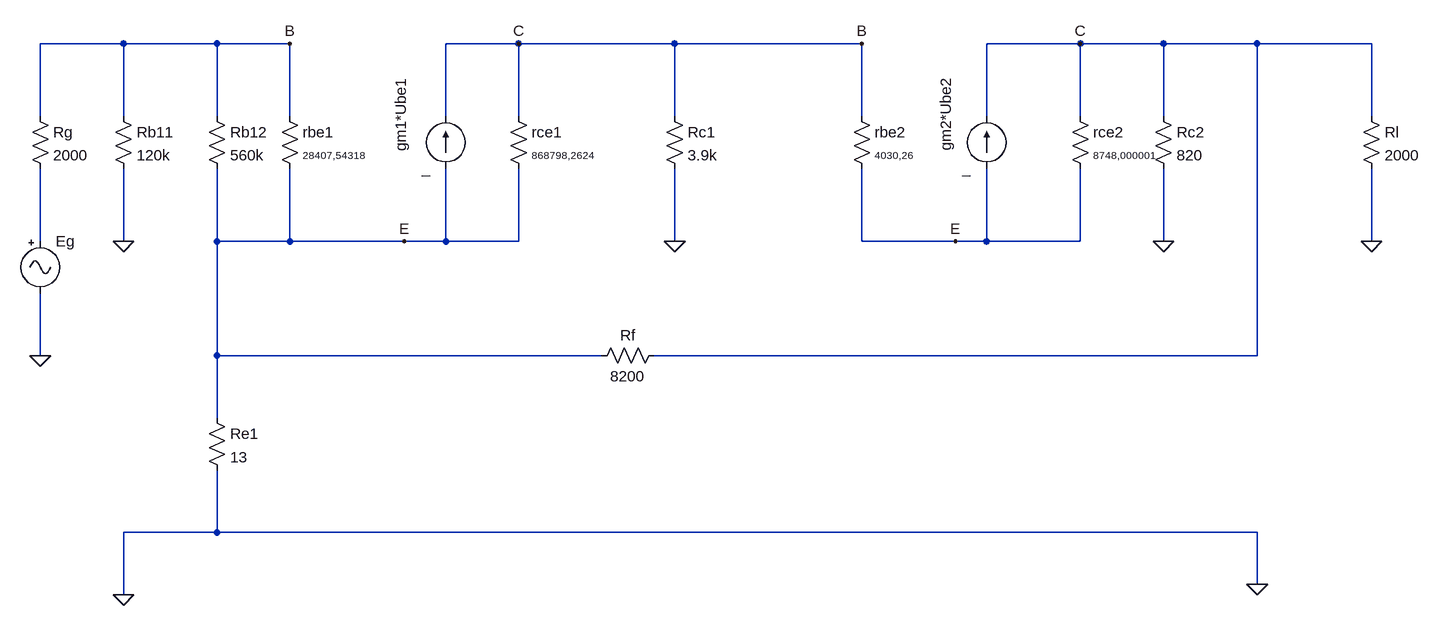
[diagram p0: schematic Approximate_analysis_equivalent_circuit.asc]
Approximate_analysis_equivalent_circuit.asc, the LTspice schematic file:
Version 4
SHEET 1 2116 868
WIRE 112 0 -16 0
WIRE 256 0 112 0
WIRE 368 0 256 0
WIRE 720 0 608 0
WIRE 960 0 720 0
WIRE 1248 0 960 0
WIRE 1584 0 1440 0
WIRE 1712 0 1584 0
WIRE 1856 0 1712 0
WIRE 2032 0 1856 0
WIRE -16 112 -16 0
WIRE 112 112 112 0
WIRE 256 112 256 0
WIRE 368 112 368 0
WIRE 608 112 608 0
WIRE 720 112 720 0
WIRE 960 112 960 0
WIRE 1248 112 1248 0
WIRE 1440 112 1440 0
WIRE 1584 112 1584 0
WIRE 1712 112 1712 0
WIRE 2032 112 2032 0
WIRE -16 304 -16 192
WIRE 112 304 112 192
WIRE 256 304 256 192
WIRE 368 304 368 192
WIRE 368 304 256 304
WIRE 544 304 368 304
WIRE 608 304 608 192
WIRE 608 304 544 304
WIRE 720 304 720 192
WIRE 720 304 608 304
WIRE 960 304 960 192
WIRE 1248 304 1248 192
WIRE 1392 304 1248 304
WIRE 1440 304 1440 192
WIRE 1440 304 1392 304
WIRE 1584 304 1584 192
WIRE 1584 304 1440 304
WIRE 1712 304 1712 192
WIRE 2032 304 2032 192
WIRE -16 480 -16 384
WIRE 256 480 256 304
WIRE 848 480 256 480
WIRE 1856 480 1856 0
WIRE 1856 480 928 480
WIRE 256 576 256 480
WIRE 256 752 256 656
WIRE 256 752 112 752
WIRE 1856 752 256 752
WIRE 1856 832 1856 752
WIRE 112 848 112 752
FLAG 112 304 0
FLAG 960 304 0
FLAG 1712 304 0
FLAG 2032 304 0
FLAG 112 848 0
FLAG 1856 832 0
FLAG -16 480 0
FLAG 368 0 B
FLAG 1248 0 B
FLAG 544 304 E
FLAG 1392 304 E
FLAG 1584 0 C
FLAG 720 0 C
SYMBOL res -32 96 R0
SYMATTR InstName Rg
SYMATTR Value 2000
SYMBOL res 96 96 R0
SYMATTR InstName Rb11
SYMATTR Value 120k
SYMBOL res 240 96 R0
SYMATTR InstName Rb12
SYMATTR Value 560k
SYMBOL res 352 96 R0
WINDOW 3 36 76 Left 1
SYMATTR InstName rbe1
SYMATTR Value 28407,54318
SYMBOL current 608 192 R180
WINDOW 0 69 26 VRight 2
WINDOW 3 24 0 Left 2
SYMATTR InstName gm1*Ube1
SYMATTR Value _
SYMBOL current 1440 192 R180
WINDOW 0 63 27 VRight 2
WINDOW 3 24 0 Left 2
SYMATTR InstName gm2*Ube2
SYMATTR Value _
SYMBOL res 704 96 R0
WINDOW 3 36 76 Left 1
SYMATTR InstName rce1
SYMATTR Value 868798,2624
SYMBOL res 944 96 R0
SYMATTR InstName Rc1
SYMATTR Value 3.9k
SYMBOL res 1232 96 R0
WINDOW 3 36 76 Left 1
SYMATTR InstName rbe2
SYMATTR Value 4030,26
SYMBOL res 1568 96 R0
WINDOW 3 36 76 Left 1
SYMATTR InstName rce2
SYMATTR Value 8748,000001
SYMBOL res 1696 96 R0
SYMATTR InstName Rc2
SYMATTR Value 820
SYMBOL res 2016 96 R0
SYMATTR InstName Rl
SYMATTR Value 2000
SYMBOL res 944 464 R90
WINDOW 0 0 56 VBottom 2
WINDOW 3 32 56 VTop 2
SYMATTR InstName Rf
SYMATTR Value 8200
SYMBOL res 240 560 R0
SYMATTR InstName Re1
SYMATTR Value 13
SYMBOL Misc\\signal -16 288 R0
SYMATTR InstName Eg
SYMATTR Value ""

The netlist it stands for:
* Approximate_analysis_equivalent_circuit.asc
Rg C N001 2000
Rb11 C 0 120k
Rb12 C E 560k
rbe1 C E 28407,54318
I§gm1*Ube1 E C _
I§gm2*Ube2 E C _
rce1 C E 868798,2624
Rc1 C 0 3.9k
rbe2 C E 4030,26
rce2 C E 8748,000001
Rc2 C 0 820
Rl C 0 2000
Rf C E 8200
Re1 E 0 13
V§Eg N001 0
.backanno
.end